# Altium schematic sheet 4 Channel ADC.SchDoc
size A4
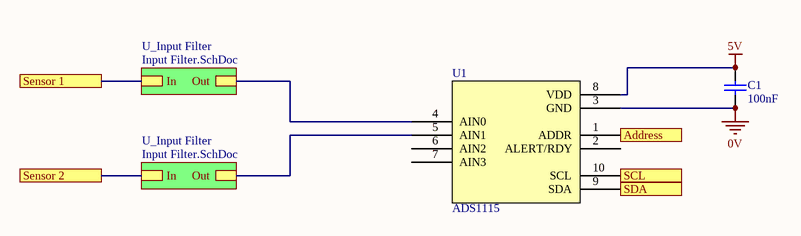
[diagram p0: 4 Channel ADC.SchDoc]

## Parts
C1  100nF  [0805]
U1  ADS1115  [TI 10-VSSOP]

## Sub-sheets
U_Input Filter = Input Filter.SchDoc: In, Out
U_Input Filter = Input Filter.SchDoc: In, Out

## Ports
Address, SCL, SDA, Sensor 1, Sensor 2

## Nets
0V: C1.1 U1.3(GND)
5V: C1.2 U1.8(VDD)
Address: U1.1(ADDR) ; port Address
SCL: U1.10(SCL) ; port SCL
SDA: U1.9(SDA) ; port SDA
Sensor 1: port Sensor 1, sheet U_Input Filter/In
Sensor 2: port Sensor 2, sheet U_Input Filter/In
NetU1_4: U1.4(AIN0) ; sheet U_Input Filter/Out
NetU1_5: U1.5(AIN1) ; sheet U_Input Filter/Out

Not connected (* = marked no-connect by the designer): U1 2(ALERT/RDY) 6(AIN2) 7(AIN3)

## Library data of the parts
C1 = GCM21BR71E104KA37L: Manufacturer: muRata; Tolerance: 10%; Material: X7R; Rated Voltage: 25V; Part Number: GCM21BR71E104KA37L; Value: 100nF
U1 = ADS1115: 16 Bit Analog to Digital Converter 2, 4 Input 1 Sigma-Delta 10-VSSOP; Manufacturer: Texas Instruments; Part Number: ADS1115; Digikey Part Number: 296-38849-1-ND; Digikey Link: https://www.digikey.com/product-detail/en/texas-instruments/ADS1115IDGSR/296-38849-1-ND/5142969